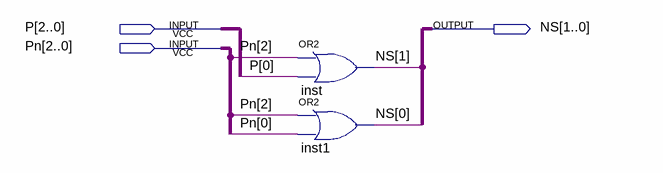
[diagram p0: schematic sheet]
// Quartus schematic NorthSouth.bdf as structural Verilog: 2 symbols, 3 pins
module NorthSouth (
  input  [2:0] P,
  input  [2:0] Pn,
  output [1:0] NS
);

  or inst (NS[1], Pn[2], P[0]);
  or inst1 (NS[0], Pn[2], Pn[0]);
endmodule
